# EAGLE design top-100-68-shield (EAGLE 9.6.2)
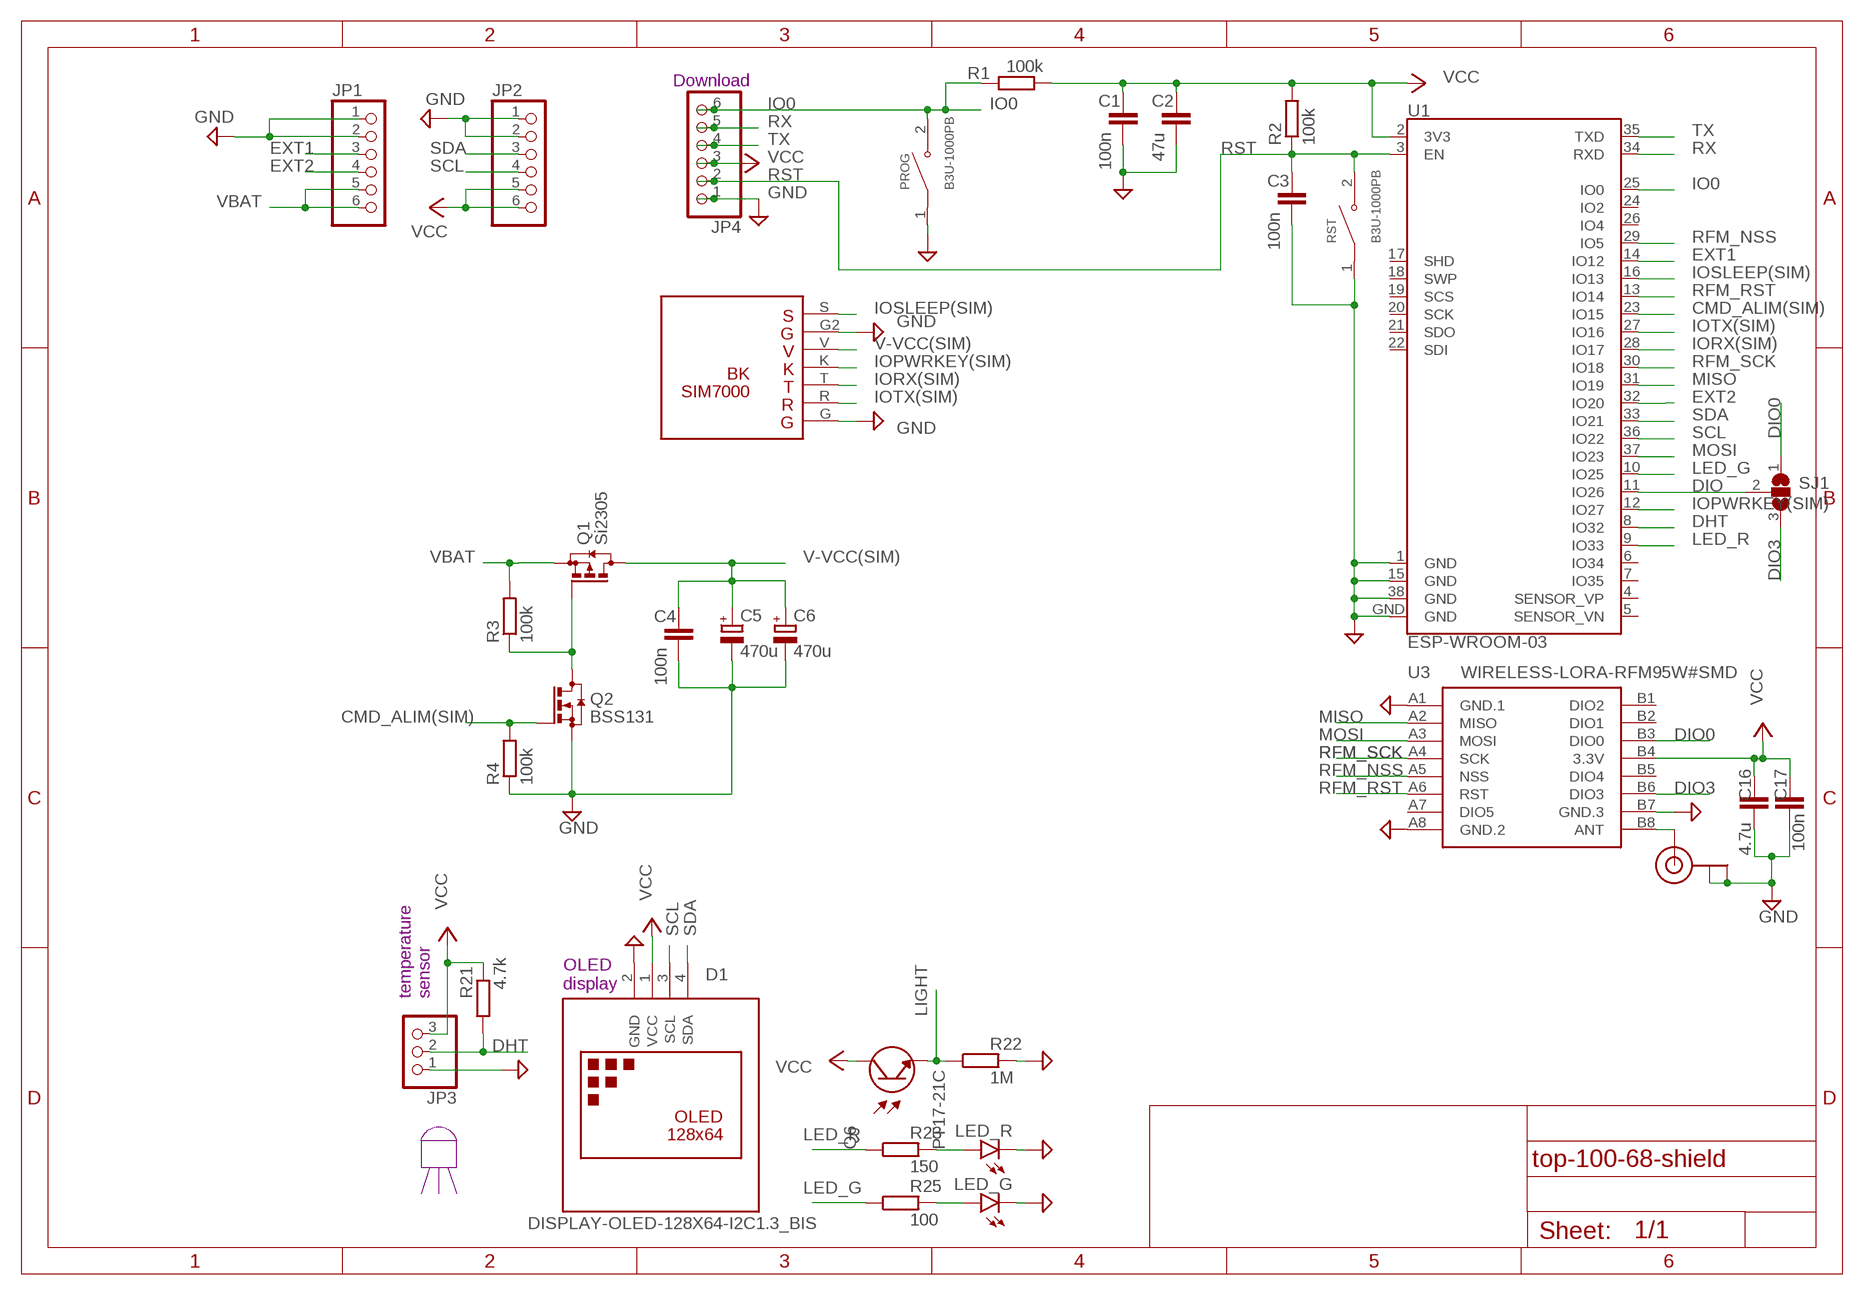
[diagram p0: schematic, sheet 1]

## Parts
C1  100n  CC1206  [C1206]
C2  47u  C  [C0805]
C3  100n  CC1206  [C1206]
C4  100n  CC1206  [C1206]
C5  470u  CPOL-EUCT7343  [CT7343]
C6  470u  CPOL-EUCT7343  [CT7343]
C16  4.7u  CC1210  [C1210]
C17  100n  CC1206  [C1206]
D1  DISPLAY-OLED-128X64-I2C1.3_BIS  [DISPLAY-OLED-128X64-1.3-I2C_BIS]
J1  U.FL  [U.FL]
JP1  PINHD-1X6S  [1X06S]
JP2  PINHD-1X6S  [1X06S]
JP3  PINHD-1X3  [1X03]
JP4  PINHD-1X6S  [1X06S]
LED_G  LEDSMT1206  [1206]
LED_R  LEDSMT1206  [1206]
PROG  B3U-1000PB  [SW_B3U-1000PB]
Q1  Si2305  BSS84  [SOT23]
Q2  BSS131  BSS123  [SOT23]
Q6  PT17-21C  [0805]
R1  100k  RR1206  [R1206]
R2  100k  RR1206  [R1206]
R3  100k  RR1206  [R1206]
R4  100k  RR1206  [R1206]
R21  4.7k  RR1206  [R1206]
R22  1M  RR1206  [R1206]
R23  150  RR1206  [R1206]
R25  100  RR1206  [R1206]
RST  B3U-1000PB  [SW_B3U-1000PB]
SJ1  SJ2W  [SJ_2]
U1  ESP-WROOM-03  [ESP-WROOM-03]
U2  BK7000-V2  [SIM7000-BK]
U3  WIRELESS-LORA-RFM95W#SMD  [WIRELESS-LORA-RFM95W#SMD]

## Nets
ANT: J1.3(SIGNAL) U3.B8(ANT)
CMD_ALIM(SIM): Q2.1(G) R4.2 U1.23(IO15)
DHT: JP3.2 R21.1 U1.8(IO32)
DIO: SJ1.2 U1.11(IO26)
DIO0: SJ1.1 U3.B3(DIO0)
DIO3: SJ1.3 U3.B6(DIO3)
EXT1: JP1.3 U1.14(IO12)
EXT2: JP1.4 U1.32(IO20)
GND: C1.2 C2.2 C3.2 C4.2 C5.- C6.- C16.2 C17.2 D1.2(GND) J1.1(GND) J1.2(GND) JP1.1 JP1.2 JP2.1 JP2.2 JP3.1 JP4.1 LED_G.C LED_R.C PROG.1 Q2.2(S) R4.1 R22.2 RST.1 U1.1(GND) U1.15(GND) U1.38(GND) U1.GND U2.G U2.G2 U3.A1(GND.1) U3.A8(GND.2) U3.B7(GND.3)
IO0: JP4.6 PROG.2 R1.2 U1.25(IO0)
IOPWRKEY(SIM): U1.12(IO27) U2.K
IORX(SIM): U1.28(IO17) U2.T
IOSLEEP(SIM): U1.16(IO13) U2.S
IOTX(SIM): U1.27(IO16) U2.R
LED_G: R25.1 U1.10(IO25)
LED_R: R23.1 U1.9(IO33)
LIGHT: Q6.1(E) R22.1
MISO: U1.31(IO19) U3.A2(MISO)
MOSI: U1.37(IO23) U3.A3(MOSI)
N$1: Q1.1(G) Q2.3(D) R3.1
N$7: LED_R.A R23.2
N$8: LED_G.A R25.2
RFM_NSS: U1.29(IO5) U3.A5(NSS)
RFM_RST: U1.13(IO14) U3.A6(RST)
RFM_SCK: U1.30(IO18) U3.A4(SCK)
RST: C3.1 JP4.2 R2.1 RST.2 U1.3(EN)
RX: JP4.5 U1.34(RXD)
SCL: D1.3(SCL) JP2.4 U1.36(IO22)
SDA: D1.4(SDA) JP2.3 U1.33(IO21)
TX: JP4.4 U1.35(TXD)
V-VCC(SIM) [POWER]: C4.1 C5.+ C6.+ Q1.3(D) U2.V
VBAT: JP1.5 JP1.6 Q1.2(S) R3.2
VCC [POWER]: C1.1 C2.1 C16.1 C17.1 D1.1(VCC) JP2.5 JP2.6 JP3.3 JP4.3 Q6.2(C) R1.1 R2.2 R21.2 U1.2(3V3) U3.B4(3.3V)
Unconnected: U1.4(SENSOR_VP) U1.5(SENSOR_VN) U1.6(IO34) U1.7(IO35) U1.17(SHD) U1.18(SWP) U1.19(SCS) U1.20(SCK) U1.21(SDO) U1.22(SDI) U1.24(IO2) U1.26(IO4) U3.A7(DIO5) U3.B1(DIO2) U3.B2(DIO1) U3.B5(DIO4)

## Notes on the sheet
- Download
- OLED 
  display
- temperature
  sensor

## Library data of the parts
C1-C4 C16 C17 = eagle-ltspice:C: CAPACITOR, European symbol; SPICEMODEL: NONE; SPICEPREFIX: C
C5 C6 = rcl:CPOL-EU: POLARIZED CAPACITOR, European symbol; SPICEPREFIX: C
D1 = diy-modules1.8-perso:DISPLAY-OLED-128X64-I2C: 128x64 Dot Matrix OLED Module based on SSD1306 chip Variant with I2C interface More details available here: http://www.instructables.com/id/Monochrome-096-i2c-OLED-display-with-arduino-SSD13/ SSD1306 datasheet: https://cdn-shop.adafruit.com/datasheets/SSD1306.pdf Click here to find device on ebay.com <http://www.ebay.com/sch/oled+display+128x64+iic> Note: There are two variants: I2C and SPI. Search for the proper version.
J1 = microbuilder:U.FL: U.FL Antenna Connector
JP1 JP2 JP4 = pinheadCP:PINHD-1X6: PIN HEADER
JP3 = pinhead:PINHD-1X3: PIN HEADER
LED_G LED_R = led:LED: LED OSRAM: - CHIPLED LG R971, LG N971, LY N971, LG Q971, LY Q971, LO R971, LY R971 LH N974, LH R974 LS Q976, LO Q976, LY Q976 LO Q996 - Hyper CHIPLED LW Q18S LB Q993, LB Q99A, LB R99A - SideLED LS A670, LO A670, LY A670, LG A670, LP A670 LB A673, LV A673, LT A673, LW A673 LH A674 LY A675 LS A676, LA A676, LO A676, LY A676, LW A676 LS A679, LY A679, LG A679 - Hyper Micro SIDELED® LS Y876, LA Y876, LO Y876, LY Y876 LT Y87S - SmartLED LW L88C, LW L88S LB L89C, LB L89S, LG L890 LS L89K, LO L89K, LY L89K LS L896, LA L896, LO L896, LY L896 - TOPLED LS T670, LO T670, LY T670, LG T670, LP T670 LSG T670, LSP T670, LSY T670, LOP T670, LYG T670 LG T671, LOG T671, LSG T671 LB T673, LV T673, LT T673, LW T673 LH T674 LS T676, LA T676, LO T676, LY T676, LB T676, LH T676, LSB T676, LW T676 LB T67C, LV T67C, LT T67C, LS T67K, LO T67K, LY T67K, LW E67C LS E67B, LA E67B, LO E67B, LY E67B, LB E67C, LV E67C, LT E67C LW T67C LS T679, LY T679, LG T679 LS T770, LO T770, LY T770, LG T770, LP T770 LB T773, LV T773, LT T773, LW T773 LH T774 LS E675, LA E675, LY E675, LS T675 LS T776, LA T776, LO T776, LY T776, LB T776 LHGB T686 LT T68C, LB T68C - Hyper Mini TOPLED® LB M676 - Mini TOPLED Santana® LG M470 LS M47K, LO M47K, LY M47K Source: http://www.osram.convergy.de LUXEON: - LUMILED® LXK2-PW12-R00, LXK2-PW12-S00, LXK2-PW14-U00, LXK2-PW14-V00 LXK2-PM12-R00, LXK2-PM12-S00, LXK2-PM14-U00 LXK2-PE12-Q00, LXK2-PE12-R00, LXK2-PE12-S00, LXK2-PE14-T00, LXK2-PE14-U00 LXK2-PB12-K00, LXK2-PB12-L00, LXK2-PB12-M00, LXK2-PB14-N00, LXK2-PB14-P00, LXK2-PB14-Q00 LXK2-PR12-L00, LXK2-PR12-M00, LXK2-PR14-Q00, LXK2-PR14-R00 LXK2-PD12-Q00, LXK2-PD12-R00, LXK2-PD12-S00 LXK2-PH12-R00, LXK2-PH12-S00 LXK2-PL12-P00, LXK2-PL12-Q00, LXK2-PL12-R00 Source: www.luxeon.com KINGBRIGHT: KA-3528ASYC Source: www.kingbright.com
PROG RST = SnapEDA-Library2:B3U-1000P: Switch Tactile N.O. SPST Round Button Gull Wing 0.05A 12VDC 1.5N SMD Embossed T/R
Q1 = transistor-small-signal:BSS84: P-CHANNEL MOS FET
Q2 = transistor-small-signal:BSS123: N-CHANNEL MOS FET
Q6 = SFH_300-3_4:PT17-21C: PT17-21C/L41/TR8 Phototransistor Manufacturer : Everlight Elec Package : 0805 20mA NPN 30V 75mW 100nA 940nm ROHS
R1-R4 R21-R23 R25 = eagle-ltspice:R: RESISTOR, European symbol; SPICEMODEL: NONE; SPICEPREFIX: R
SJ1 = jumper:SJ2W: SMD solder JUMPER
U1 = esp32-sparkfun (1):ESP-WROOM-03; OC_FARNELL: unknown
U2 = MyLIB:BK7000-V2
U3 = diy-modules:WIRELESS-LORA-RFM95W: 868/915 MHz LoRa Radio Transceiver Module based on SX1276 chip Click here to find device on ebay.com <http://www.ebay.com/sch/RFM95W+transceiver>

## Net classes
0 default: width 0.32 mm, drill 0.32 mm, clearance 0.35 mm
1 POWER: width 0.5 mm, drill 0.32 mm, clearance 0.35 mm

## Board
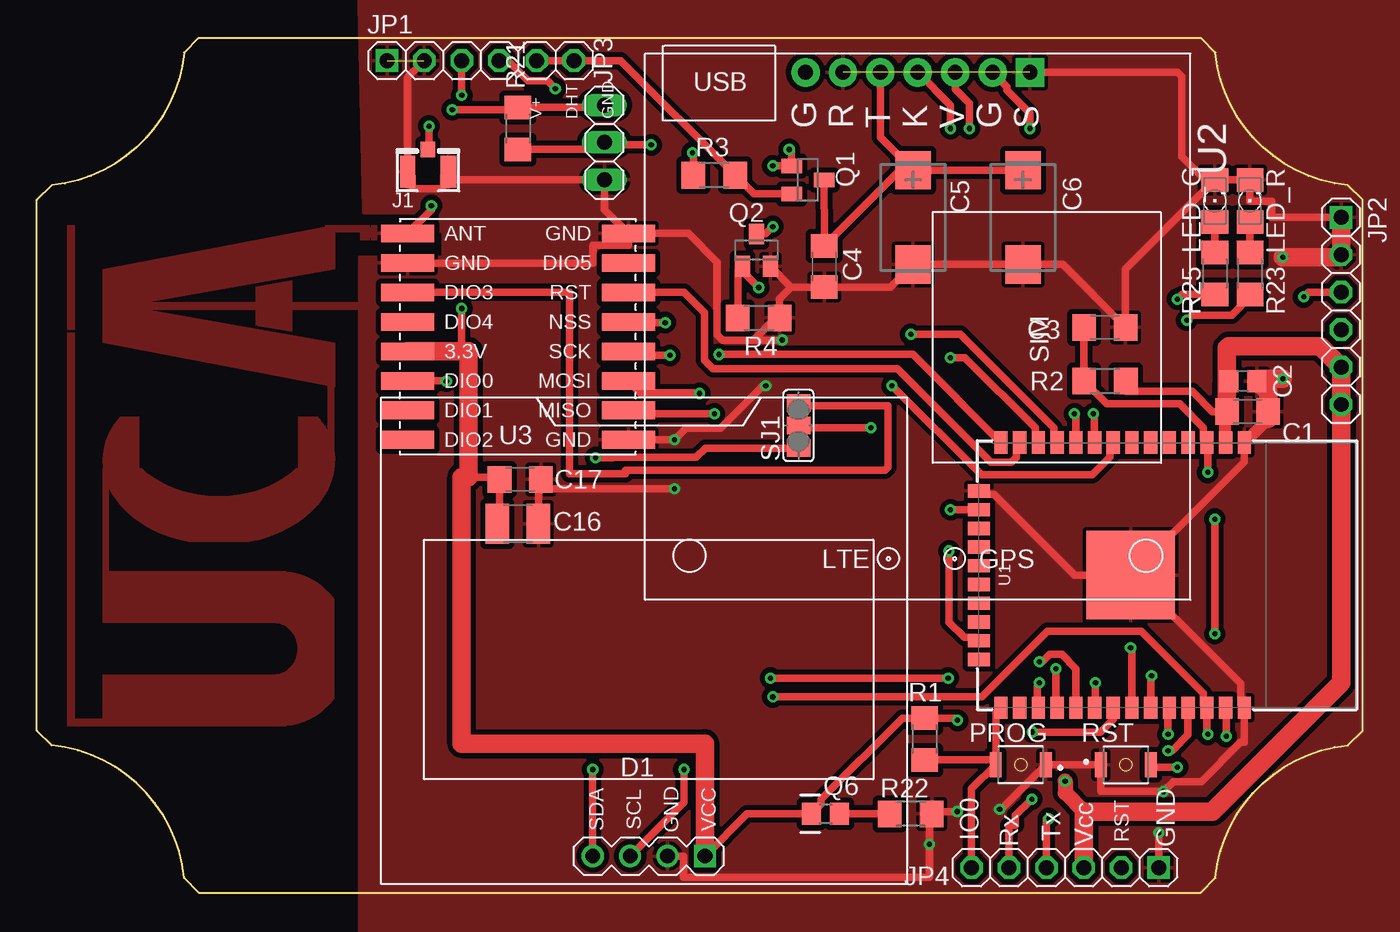
[diagram p1: board, top side]
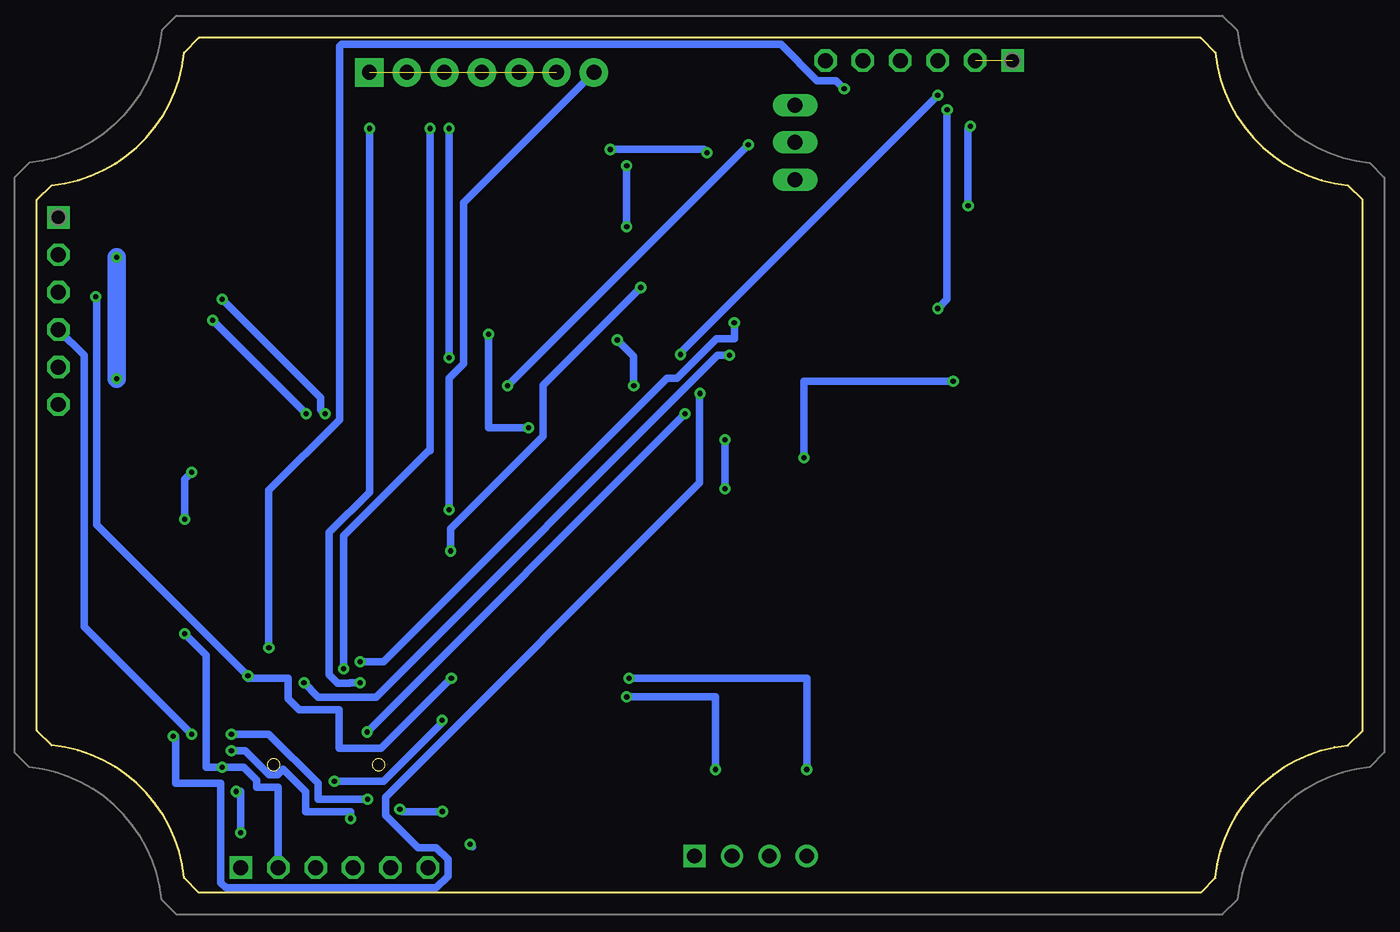
[diagram p2: board, bottom side, seen from below]

Size 90 x 58 mm. Coordinates in mm from the lower left corner, seen from the top.
Outline: 10,57 arc-79 1,48 0,47 0,11 1,10 arc-79 10,1 11,0 79,0 80,1 arc-79 89,10 90,11 90,47 89,48 arc-79 80,57 79,58 11,58 10,57
Copper layers (1*16): Top 0.035mm / dielectric 1.5mm / Bottom 0.035mm
Design rules "default *": minimum track width 6mil, minimum drill 0.35mm, track to track 6mil, track to pad 6mil, pad to pad 6mil, via to via 6mil, smd to smd 6mil, copper to edge 0mil, drill to drill 6mil, minimum pad ring 10mil, minimum via ring 8mil, stop-mask expansion 4mil, vias tented up to drill 0mil, thermal gap 10mil

### Footprints (pad centres in the part's own frame; a part is rotated, then mirrored left to right if it is on the bottom)
C1206 = smd 1.6 x 1.8: 1 -1.4,0; 2 1.4,0
C0805 = smd 1.3 x 1.5: 1 -0.95,0; 2 0.95,0
CT7343 = smd 2.6 x 2.4: + -3.2,0; - 3.2,0
C1210 = smd 1.6 x 2.7: 1 -1.4,0; 2 1.4,0
DISPLAY-OLED-128X64-1.3-I2C_BIS = drill 1 square: 1 -3.81,14.605 | drill 1: 2 -1.27,14.605; 3 1.27,14.605; 4 3.81,14.605
U.FL = smd 2.2 x 1.05: 1 0,1.375; 2 0,-1.375 | smd 1.05 x 1: 3 1.525,0
1X06S = drill 1.016 square: 1 -6.35,0 | drill 1.016 octagon: 2 -3.81,0; 3 -1.27,0; 4 1.27,0; 5 3.81,0; 6 6.35,0
1X03 = drill 1.016 long: 1 -2.54,0; 2 0,0; 3 2.54,0
1206 = smd 1.6 x 1.803: A -1.422,0; C 1.422,0
SW_B3U-1000PB = smd 0.8 x 1.7: 1 -1.7,0; 2 1.7,0
SOT23 = smd 1 x 1.4: 1 -0.95,-1.1; 2 0.95,-1.1; 3 0,1.1
0805 = smd 1.3 x 1.5: 1 0.72,0; 2 -1.18,0
R1206 = smd 1.6 x 1.803: 1 -1.422,0; 2 1.422,0
SJ_2 = smd 1.168 x 1.6: 1 -1.524,0; 2 0,0; 3 1.524,0
ESP-WROOM-03 = smd 0.9 x 1.5: 1 7.7,9; 2 6.43,9; 3 5.16,9; 4 3.89,9; 5 2.62,9; 6 1.35,9; 7 0.08,9; 8 -1.19,9; 9 -2.46,9; 10 -3.73,9; 11 -5,9; 12 -6.27,9; 13 -7.54,9; 14 -8.81,9; 25 -8.81,-9; 26 -7.54,-9; 27 -6.27,-9; 28 -5,-9; 29 -3.73,-9; 30 -2.46,-9; 31 -1.19,-9; 32 0.08,-9; 33 1.35,-9; 34 2.62,-9; 35 3.89,-9; 36 5.16,-9; 37 6.43,-9; 38 7.7,-9 | smd 1.5 x 0.9: 15 -10.3,5.715; 16 -10.3,4.445; 17 -10.3,3.175; 18 -10.3,1.905; 19 -10.3,0.635; 20 -10.3,-0.635; 21 -10.3,-1.905; 22 -10.3,-3.175; 23 -10.3,-4.445; 24 -10.3,-5.715 | smd 6 x 6: GND 0,0
SIM7000-BK = drill 1 pad 1.93 square: G 0,7.62 | drill 1 pad 1.93: G2 0,-5.08; K 0,0; R 0,5.08; S 0,-7.62; T 0,2.54; V 0,-2.54
WIRELESS-LORA-RFM95W#SMD = smd 3.6 x 1.2: A1 -7.5,7; A2 -7.5,5; A3 -7.5,3; A4 -7.5,1; A5 -7.5,-1; A6 -7.5,-3; A7 -7.5,-5; A8 -7.5,-7; B1 7.5,7; B2 7.5,5; B3 7.5,3; B4 7.5,1; B5 7.5,-1; B6 7.5,-3; B7 7.5,-5; B8 7.5,-7

### Placement (x,y rotation side)
C1  82.19,32.65 0 top
C2  81.87,34.71 0 top
C3  72.5,38.36 0 top
C4  53.45,42.49 270 top
C5  59.48,45.82 270 top
C6  66.95,45.82 270 top
C16  32.66,25.03 0 top
C17  32.81,28.04 0 top
D1  41.55,17.09 180 top
J1  26.54,48.91 90 top
JP1  30.11,56.46 0 top
JP2  88.54,39.47 270 top
JP3  38.53,50.9 90 top
JP4  69.8,1.69 180 top
LED_G  79.96,46.94 90 top
LED_R  82.34,46.94 90 top
PROG  66.79,8.68 180 top
Q1  52.34,48.36 270 top
Q2  48.85,43.6 0 top
Q6  53.77,5.34 0 top
R1  60.28,10.42 270 top
R2  72.5,34.71 0 top
R3  45.99,48.68 0 top
R4  49.01,39 180 top
R21  32.66,51.86 90 top
R22  59.33,5.34 0 top
R23  82.34,42.01 90 top
R25  79.96,42.01 90 top
RST  73.93,8.68 0 top
SJ1  51.7,31.7 90 top
U1  74.26,21.54 0 top
U2  59.8,55.67 270 top
U3  32.66,37.73 180 top

### Tracks (layer width: path | path; a pad name or v marks a point on that pad's centre or on a via)
ANT  (via drill 0.35)
  Top 0.5: U3.B8 26.78,46.35 v26.78,46.62 | v26.62,52.02 26.62,50.52 J1.3
  Bottom 0.5: v26.78,46.62 26.78,51.86 v26.62,52.02
  pour Top: 16.92,11.3 2.07,11.3 2.07,38 2.57,38 2.57,11.8 4.47,11.8 4.47,14.8 16.12,14.8 16.26,14.8 16.4,14.83 16.53,14.86 16.66,14.9 16.79,14.96 16.91,15.03 17.03,15.12 17.14,15.21 17.24,15.31 17.33,15.42 17.41,15.55 17.49,15.67 17.55,15.81 17.6,15.95 17.64,16.1 17.67,16.25 17.69,16.4 17.7,16.55 17.69,16.7 17.67,16.85 17.64,17 17.6,17.15 17.55,17.29 17.49,17.42 17.41,17.55 17.33,17.67 17.24,17.79 17.14,17.89 17.03,17.98 16.91,18.06 16.79,18.13 16.66,18.19 16.53,18.24 16.4,18.27 16.26,18.29 16.12,18.3 4.47,18.3 4.47,28.8 4.5,28.8 4.48,29.41 4.54,30.02 4.69,30.62 4.93,31.22 5.25,31.79 5.65,32.3 6.96,32.3 6.96,28.8 7.11,28.8 7.44,28.51 7.79,28.24 8.16,28 8.57,27.77 8.99,27.57 9.43,27.4 9.9,27.24 10.37,27.12 10.86,27.02 11.35,26.95 11.85,26.91 12.36,26.9 12.86,26.91 13.36,26.95 13.86,27.02 14.34,27.12 14.82,27.24 15.28,27.4 15.72,27.57 16.15,27.77 16.56,28 16.92,28.24 17.28,28.51 17.61,28.8 17.75,28.8 17.75,32.3 19.06,32.3 19.19,32.15 19.31,31.99 19.42,31.83 19.53,31.67 19.63,31.5 19.72,31.34 19.72,34.4 4.47,37.3 4.47,42.3 19.57,45.17 19.57,45.3 22.07,45.3 22.07,45.29 22.57,45.29 22.57,45.13 22.7,45.13 22.7,45.29 23.48,45.29 23.48,44.28 22.7,44.28 22.7,44.44 22.57,44.44 22.57,44.28 21.93,44.28 21.93,44.8 20.24,44.8 20.24,42.3 7.54,40.05 14.85,40.05 14.85,41.1 17.34,41.55 17.34,40.05 21.93,40.05 21.93,40.3 22.32,40.3 22.32,39.3 21.93,39.3 21.93,39.55 17.34,39.55 17.34,38.05 16.15,38.26 15.01,38.44 15.01,38.47 14.85,38.5 14.85,39.55 7.54,39.55 20.24,37.3 20.24,34.3 20.17,34.31 20.17,30.06 20.23,29.51 20.23,28.97 20.15,28.42 19.99,27.88 19.77,27.36 19.49,26.86 19.12,26.36 18.7,25.91 18.24,25.5 17.69,25.1 17.11,24.75 16.5,24.45 15.83,24.18 15.14,23.96 14.43,23.8 10.29,23.8 9.68,23.93 9.09,24.11 8.5,24.32 7.97,24.56 7.45,24.84 6.95,25.15 6.51,25.47 6.1,25.83 5.72,26.22 5.41,26.61 5.13,27.03 4.89,27.47 4.89,21.8 16.92,21.8 16.92,21.78 17.34,21.73 17.75,21.64 18.14,21.5 18.53,21.33 18.9,21.12 19.25,20.88 19.58,20.6 19.89,20.29 20.17,19.95 20.17,13.15 19.89,12.81 19.58,12.5 19.25,12.22 18.9,11.98 18.53,11.77 18.14,11.6 17.75,11.46 17.34,11.37 16.92,11.31
ANT1
  pour Top: 2.57,38.2 2.07,38.2 2.07,45.3 2.57,45.3
CMD_ALIM(SIM)  (via drill 0.35)
  Top 0.5: R4.2 47.58,42.19 Q2.1 47.9,42.17 v49.01,41.06 | U1.23 63.74,17.32 62.96,17.32 61.92,18.36 v61.92,23.18
  Bottom 0.5: v61.92,23.18 61.92,24.7 55.65,30.97 55.65,34.42 v49.01,41.06
DHT  (via drill 0.35)
  Top 0.5: R21.1 38.06,50.43 JP3.2 38.69,50.75 v41.7,50.75 | U1.8 72.85,30.32 72.85,29.54 71.65,28.34 64.11,28.34 v58.05,34.39
  Bottom 0.5: v58.05,34.39 v41.7,50.75
DIO  (via drill 0.35)
  Top 0.5: v56.63,31.54 51.86,31.54 SJ1.2 | U1.11 69.04,30.76 69.04,31.54 62.69,37.89 v59.32,37.89
  Bottom 0.5: v59.32,37.89 59.32,31.54 v56.63,31.54
DIO0  (via drill 0.35)
  Top 0.5: SJ1.1 45.39,30.17 44.74,29.53 39.11,29.53 39.11,29.52 v37.94,29.52 | U3.B3 v27.8,34.73 v27.8,34.71
  Bottom 0.5: v27.8,34.71 37.94,34.71 v37.94,29.52
DIO3
  Top 0.5: SJ1.3 51.89,33.04 57.76,33.04 57.76,28.87 57.58,28.68 39.96,28.68 39.96,28.44 36.15,28.44 36.15,40.74 28.94,40.74 28.94,40.73 U3.B6
EXT1  (via drill 0.35)
  Top 0.5: JP1.3 v28.84,54.1 | v46.31,36.52 59.47,36.52 U1.14
  Bottom 0.5: v28.84,54.1 46.31,36.64 v46.31,36.52
EXT2  (via drill 0.35)
  Top 0.5: JP1.4 32,56.46 33.36,55.1 34.65,55.1 v35.19,54.56 | U1.32 74.34,16.52 v74.25,16.61
  Bottom 0.5: v74.25,16.61 74.25,27.3 69.46,32.08 69.46,57.44 69.33,57.57 39.5,57.57 37.03,55.1 35.74,55.1 v35.19,54.56
GND  (via drill 0.35)  (2 unrouted)
  Top 0.5: R22.2 61.23,4.71 | LED_R.C | U2.G 77.42,55.67 77.74,55.35 77.74,49.94 79.32,48.36 LED_G.C | Q2.2 51.21,41.09 | 39.62,44.73 U3.A8 | 48.63,37.5 46.54,37.5 46.18,37.85 46.18,42.77 44.23,44.73 U3.A8 | 48.63,37.5 50.13,39 R4.1 50.43,40.31 51.21,41.09 | U3.B7 37.75,42.72 37.75,43.93 40.15,43.93 U3.A8 | JP1.2 25.17,55.32 J1.1 25.47,48.62 25.47,47.92 25.61,47.78 27.47,47.78 27.62,47.92 27.62,48.62 J1.2 28.47,48.36 JP3.1 38.53,46.35 U3.A8 | R22.2 60.91,5.5 v62.47,5.5 | v65.36,5.66 65.47,5.66 PROG.1 RST.1 72.23,6.86 v76.47,6.86 77.14,7.54 79.05,7.54 81.71,10.2 81.96,10.2 U1.38 81.74,12.76 81.74,14.18 74.37,21.54 U1.GND | R22.2 60.59,5.19 v60.59,3.28 60.59,1.03 43.9,1.03 43.9,2.49 D1.2 | U1.15 64.18,27.04 64.96,27.04 70.45,21.54 U1.GND | U1.1 81.96,29.24 U1.GND | LED_G.C 73.9,42.3 C3.2 69.64,42.62 C6.- C5.- 57.95,41.09 C4.2 51.21,41.09 | LED_G.C LED_R.C | JP2.1 83.85,45.82 83.85,46.91 82.35,46.91 LED_R.C | JP4.1 v76.15,4.07 | C16.2 34.05,27.89 C17.2 34.85,27.41 v43.29,27.41 | U3.A1 43.28,30.73 v43.29,30.74 44.06,31.51 46.39,31.51 49.28,34.39 v49.48,34.39 | v50.59,37.5 48.63,37.5
  Top 0.813: U1.1 83.58,32.17
  Top 1.27: 83.58,32.17 C1.2 83.58,33.94 C2.2 82.98,34.87 v84.57,34.87 | JP2.1 JP2.2 88.38,43.13 v84.57,43.13
  Bottom 0.5: v62.47,5.5 65.2,5.5 v65.36,5.66 | v60.59,3.28 60.44,3.12 | v76.15,4.07 76.15,6.86 v76.47,6.86 | v43.29,27.41 v43.29,30.74 | v49.48,34.39 49.48,36.38 v50.59,37.5
  Bottom 1.27: v84.57,34.87 v84.57,43.13
  pour Bottom (isolate 0.406): 141.88,15.66 141.88,73.45 201.41,73.45 202.2,72.65 202.2,68.39 204.91,66.37 205.02,23.38 203.08,21.55 203.08,20.99 202.66,20.57 201.86,16.27 201.25,15.66
  pour Top: 21.92,43.12 21.92,-3.39 97.27,-3.39 97.27,61.86 21.86,61.86 22.18,46.3 22.18,46.14 27.42,46.14 27.42,44.87 27.57,44.87 27.57,43.12
IO0
  Top 0.5: JP4.6 63.45,7.04 PROG.2 | PROG.2 65.09,12.18 U1.25 | R1.2 64.76,9 PROG.2
IOPWRKEY(SIM)  (via drill 0.35)
  Top 0.5: U1.12 67.77,30.76 67.77,31.54 63.01,36.3 v62.02,36.3 | v62.02,51.86 62.02,53.44 U2.K
  Bottom 0.5: v62.02,36.3 v62.02,51.86
IORX(SIM)  (via drill 0.35)
  Top 0.5: U2.T 62.34,54.51 63.29,53.56 v63.29,51.86 | v69.17,15.19 69.17,12.63 U1.28
  Bottom 0.5: v69.17,15.19 69.17,24.23 63.35,30.05 63.29,29.99 v63.29,51.86
IOSLEEP(SIM)  (via drill 0.35)
  Top 0.5: v62.02,25.98 v62.03,25.99 U1.16
  Bottom 0.5: v62.02,25.98 62.02,34.92 61.05,35.89 61.05,46.8 U2.S
IOTX(SIM)  (via drill 0.35)
  Top 0.5: U1.27 67.93,12.6 67.93,14.1 v68.06,14.23 | U2.R 65.86,54.69 65.86,54.45 67.42,52.89 v67.42,51.86
  Bottom 0.5: v67.42,51.86 67.42,27.18 70.15,24.46 70.15,14.78 69.57,14.21 68.76,14.21 68.74,14.23 v68.06,14.23
LED_G  (via drill 0.35)
  Top 0.5: U1.10 70.53,32.4 v70.44,32.49 | v77.42,40.27 77.75,40.59 R25.1
  Bottom 0.5: v70.44,32.49 70.73,32.78 70.73,33.57 v77.42,40.27
LED_R  (via drill 0.35)
  Top 0.5: v71.71,32.49 71.8,32.4 U1.9 | v78.06,38.84 78.41,39.19 81.11,39.19 82.34,40.42 R23.1
  Bottom 0.5: v71.71,32.49 v78.06,38.84
LIGHT
  Top 0.5: R22.1 Q6.1
MISO  (via drill 0.35)
  Top 0.5: v45.99,32.49 40.39,32.49 U3.A2 | U1.31 73.07,11.76 72.2,10.9 v67.58,10.9
  Bottom 0.5: v45.99,32.49 v67.58,10.9
MOSI  (via drill 0.35)
  Top 0.5: v44.99,33.87 44.8,33.87 44.74,33.93 40.95,33.93 U3.A3 | v80.73,10.6 80.73,12.54 U1.37
  Bottom 0.5: v44.99,33.87 45.01,33.84 45.01,27.8 66.34,6.47 66.34,5.26 64.13,3.05 62.89,3.05 62.09,2.26 62.09,1.13 62.89,0.33 77.16,0.33 77.51,0.68 77.51,7.44 80.57,7.44 80.57,10.6 v80.73,10.6
N$1  (via drill 0.35)
  Top 0.5: v49.96,49.32 v49.96,49.31 Q1.1 51.24,50.26 v51.07,50.43 | v49.96,45.19 49.47,44.7 Q2.3 | R3.1 44.57,50.14 v44.5,50.21
  Bottom 0.5: v49.96,49.32 v49.96,45.19 | v44.5,50.21 44.72,50.43 v51.07,50.43
N$7
  Top 0.5: R23.2 LED_R.A
N$8
  Top 0.5: LED_G.A R25.2
RFM_NSS  (via drill 0.35)
  Top 0.5: v68.06,15.66 68.26,15.66 68.76,16.16 69.57,16.16 70.53,15.21 U1.29 | U3.A5 40,38.73 40,38.68 v42.66,38.68
  Bottom 0.5: v68.06,15.66 66.47,15.66 47.23,34.9 46.54,34.9 43.87,37.57 42.66,37.57 v42.66,38.68
RFM_RST
  Top 0.5: U1.13 66.5,30.32 66.5,29.54 66.15,29.19 64.75,29.19 58.4,35.54 45.9,35.54 45.33,36.11 45.33,39.34 43.94,40.73 U3.A6
RFM_SCK  (via drill 0.35)
  Top 0.5: v71.87,14.23 71.87,12.61 U1.30 | v42.97,36.46 40.15,36.46 U3.A4
  Bottom 0.5: v71.87,14.23 70.89,13.25 66.99,13.25 43.78,36.46 v42.97,36.46
RST  (via drill 0.35)
  Top 0.5: C3.1 71.08,38.34 R2.1 72.63,33.16 77.58,33.16 79.2,31.54 79.2,30.76 U1.3 79.49,30.47 v79.49,28.52 | v77.42,8.52 75.79,8.52 RST.2 | v79.96,17.57 v79.96,25.35
  Bottom 0.5: v79.96,17.57 78.51,16.11 78.51,8.52 v77.42,8.52 75.96,8.52 75.06,7.62 75.06,7.14 73.61,7.14 JP4.2 | v79.96,25.35 79.96,28.04 v79.49,28.52
RX  (via drill 0.35)
  Top 0.5: v76.79,10.74 76.79,12.45 U1.34 | JP4.5 65.99,4.58 66.44,4.58 66.44,5.24 v67.53,6.34
  Bottom 0.5: v76.79,10.74 74.25,10.74 70.91,7.41 70.91,6.34 v67.53,6.34
SCL  (via drill 0.35)
  Top 0.5: v79.49,10.74 79.42,10.81 U1.36 79.2,12.76 79.2,13.54 74.99,17.75 68.61,17.75 64.14,13.28 v49.96,13.28 | D1.3 43.93,6.14 v43.93,8.36
  Bottom 0.5: v79.49,10.74 86.79,18.04 86.79,36.46 JP2.4 | v43.93,8.36 43.93,13.28 v49.96,13.28
SDA  (via drill 0.35)
  Top 0.5: U1.33 75.61,14.64 v75.68,14.71 | v61.86,14.55 v49.8,14.55 | v85.99,40.43 86.31,40.74 JP2.3 | v37.73,8.36 D1.4
  Bottom 0.5: v61.86,14.55 66.63,9.79 69.48,9.79 69.48,12.4 72.2,12.4 72.95,13.15 72.95,14.55 75.68,14.55 v75.68,14.71 85.94,24.97 85.94,40.37 v85.99,40.43 | v49.8,14.55 37.73,14.55 v37.73,8.36
TX  (via drill 0.35)
  Top 0.5: v76.79,9.63 77.06,9.63 78.15,10.72 U1.35 | v68.69,5.03 68.53,5.03 JP4.4
  Bottom 0.5: v68.69,5.03 68.69,5.49 71.76,5.49 71.76,6.86 73.27,8.36 73.64,7.99 74.21,7.99 75.86,9.63 v76.79,9.63
V-VCC(SIM)
  Top 0.5: C5.+ C6.+ | C5.+ 58.58,49.02 C4.1 53.45,44.41 Q1.3 | C5.+ 57.26,51.25 U2.V
VBAT
  Top 0.5: Q1.2 48.68,47.41 R3.2 39.63,56.46 JP1.6 JP1.5
VCC  (via drill 0.35)
  Top 0.5: v62.5,11.69 v62.49,11.69 62.34,11.84 R1.1 58.74,11.84 53.24,6.34 53.24,5.99 Q6.2 48.21,5.34 D1.1 | JP3.3 38.36,53.28 R21.2 32.5,53.13 v28.21,53.13 | R2.2 73.92,34.01 78.43,34.01 79.79,32.65 C1.1 | 28.84,36.73 v28.84,39.63 | C16.1 31.41,25.19 C17.1 31.25,28.2 29.32,28.2 28.84,28.2
  Top 0.813: U1.2 80.69,32.55
  Top 1.016: v69.8,7.57 69.8,6.77 71.07,5.5
  Top 1.27: C2.1 80.78,34.58 | 80.69,32.55 C1.1 80.78,34.58 | 80.78,34.58 80.78,36.96 80.91,37.09 87.11,37.09 JP2.5 JP2.6 88.53,14.23 79.8,5.5 71.07,5.5 JP4.3 | D1.1 45.35,10.11 28.84,10.11 28.84,28.2 | U3.B4 28.84,36.73 29.32,36.73 29.32,28.2
  Bottom 0.5: v62.5,11.69 62.55,11.69 62.55,11.47 66.45,7.57 v69.8,7.57 | v28.21,53.13 28.21,40.27 v28.84,39.63

### Text on the board
Top: V1.61
tNames: with external / antenna connected / on J1, cut here | A6 | V+ / / DHT / / GND | B2 | A1 | DIO0 | DIO3 | UCA antenna designed by / Fabien Ferrero | (users.polytech.unice.fr/~ferrero/recherche.html) | SDA / / SCL / / gnd / / V+ | DRDY1 gnd | GND | IO0 | Vcc | RST | Rx | Tx
bNames: http://rucher.polytech.unice.fr | LoRa Bee Scale V1.61 / Christian.PETER / @univ-cotedazur.fr | Short SJ7 if U4 used | E+ red / A/B- white / A/B+ blue/green / E- black | V+ GND SCL SDA
tValues: 84 x 58 mm